# Altium schematic sheet Kasli-SOC_bank33-34-35.SchDoc: Banks 33, 34, 35
size 420 x 297 mm; EDA_Number: EDA-03288-V3-0; CheckedBy: G.Kasprowicz; Author: F.Switakowski; CompanyName: WUT ISE; DrawnBy: F.Switakowski; Organization: WUT ISE; Address1: PW ISE; Address2: Nowowiejska 15/19 00-665 Warsaw; Address3: gkasprow@gmail.com; DocumentNumber: 7; Revision: 1; SheetNumber: 7; SheetTotal: 18; ModifiedBy: -; CheckedDate: -; Title2: EEM LVDS; DivGrp: WUT ISE; Designer: G.Kasprowicz; ModifiedDate: -; ProjectName: Sensor Box
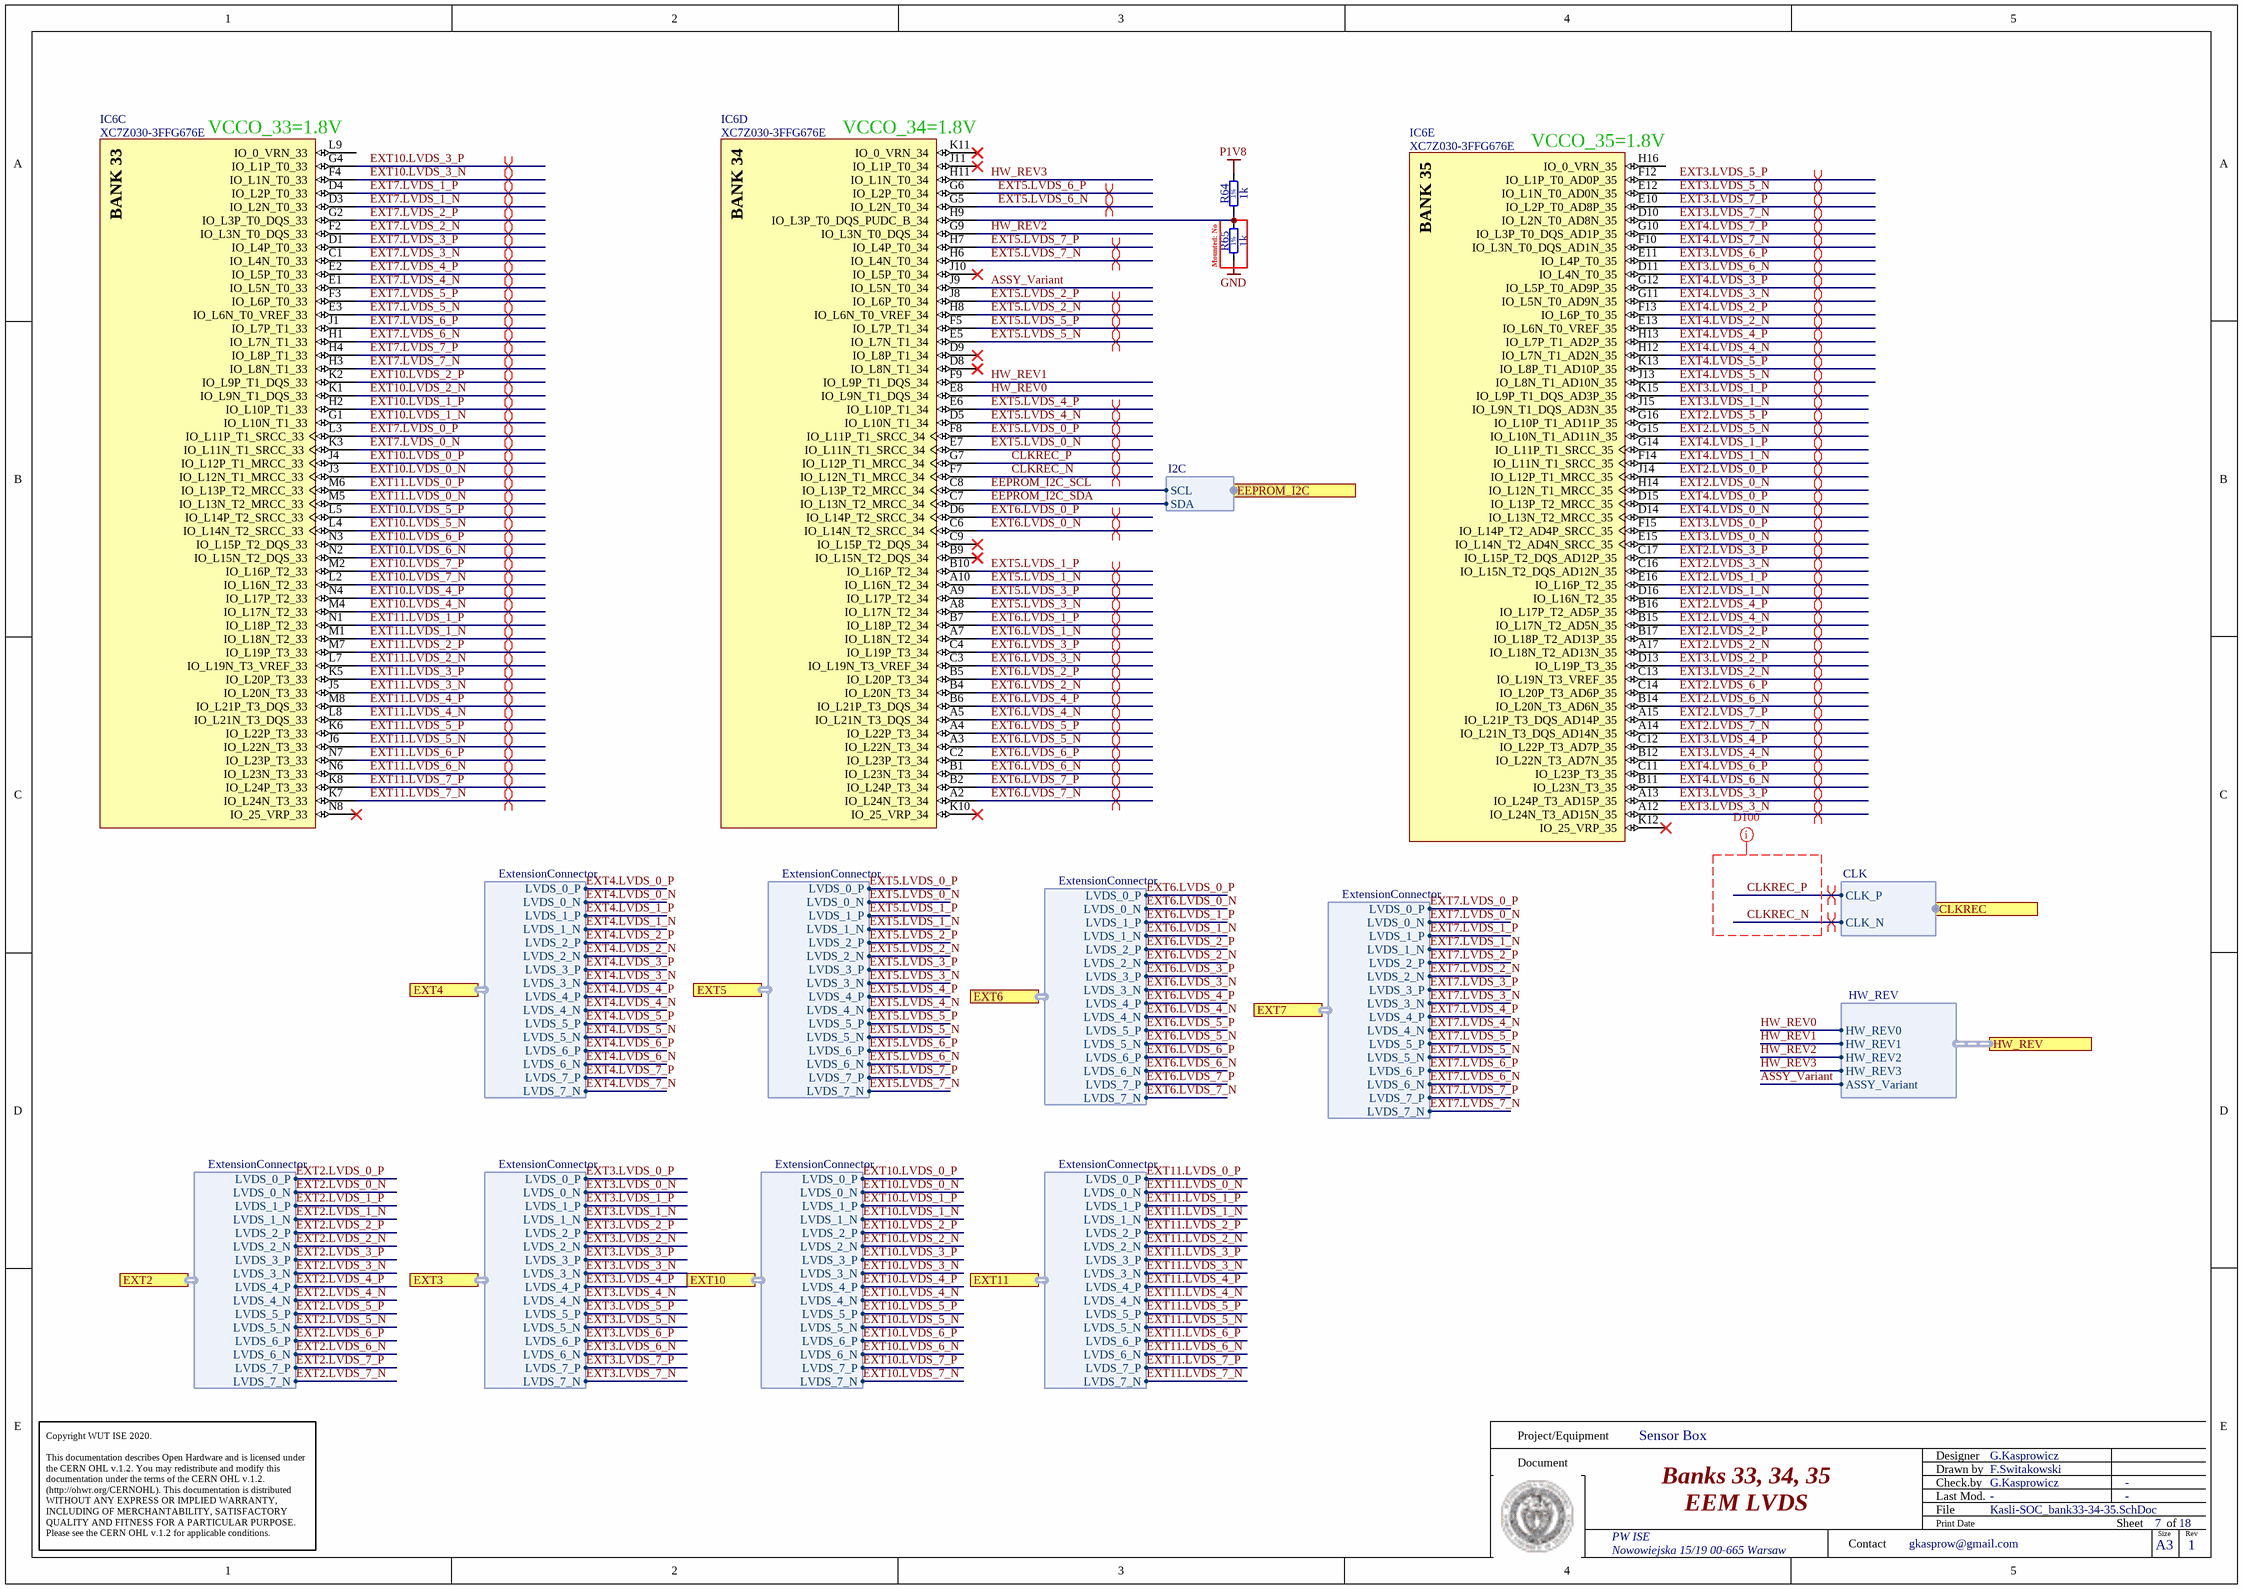
[diagram p0: Kasli-SOC_bank33-34-35.SchDoc]

## Parts
IC6  XC7Z030-3FFG676E  [BGA676C100P26X26_2700X2700X324]  (parts C,D,E of 14)
R64  1k  [RESC1005X40N]
R65  1k  [RESC1005X40N]

## Ports
CLKREC (harness CLK), EEPROM_I2C (harness I2C), EXT2 (harness ExtensionConnector), EXT3 (harness ExtensionConnector), EXT4 (harness ExtensionConnector), EXT5 (harness ExtensionConnector), EXT6 (harness ExtensionConnector), EXT7 (harness ExtensionConnector), EXT10 (harness ExtensionConnector), EXT11 (harness ExtensionConnector), HW_REV (harness HW_REV)

## Harnesses
ExtensionConnector: LVDS_0_N, LVDS_0_P, LVDS_1_N, LVDS_1_P, LVDS_2_N, LVDS_2_P, LVDS_3_N, LVDS_3_P, LVDS_4_N, LVDS_4_P, LVDS_5_N, LVDS_5_P, LVDS_6_N, LVDS_6_P, LVDS_7_N, LVDS_7_P
CLK: CLK_P, CLK_N
I2C: SDA, SCL
HW_REV: ASSY_Variant, HW_REV3, HW_REV2, HW_REV1, HW_REV0

## Nets
GND: R65.1
P1V8: R64.2
ASSY_Variant: IC6.J9(IO_L5N_T0_34) ; port HW_REV.ASSY_Variant
CLKREC_N: IC6.F7(IO_L12N_T1_MRCC_34) ; port CLKREC.CLK_N
CLKREC_P: IC6.G7(IO_L12P_T1_MRCC_34) ; port CLKREC.CLK_P
EEPROM_I2C_SCL: IC6.C8(IO_L13P_T2_MRCC_34) ; port EEPROM_I2C.SCL
EEPROM_I2C_SDA: IC6.C7(IO_L13N_T2_MRCC_34) ; port EEPROM_I2C.SDA
EXT2.LVDS_0_N: IC6.H14(IO_L12N_T1_MRCC_35) ; port EXT2.LVDS_0_N
EXT2.LVDS_0_P: IC6.J14(IO_L12P_T1_MRCC_35) ; port EXT2.LVDS_0_P
EXT2.LVDS_1_N: IC6.D16(IO_L16N_T2_35) ; port EXT2.LVDS_1_N
EXT2.LVDS_1_P: IC6.E16(IO_L16P_T2_35) ; port EXT2.LVDS_1_P
EXT2.LVDS_2_N: IC6.A17(IO_L18N_T2_AD13N_35) ; port EXT2.LVDS_2_N
EXT2.LVDS_2_P: IC6.B17(IO_L18P_T2_AD13P_35) ; port EXT2.LVDS_2_P
EXT2.LVDS_3_N: IC6.C16(IO_L15N_T2_DQS_AD12N_35) ; port EXT2.LVDS_3_N
EXT2.LVDS_3_P: IC6.C17(IO_L15P_T2_DQS_AD12P_35) ; port EXT2.LVDS_3_P
EXT2.LVDS_4_N: IC6.B15(IO_L17N_T2_AD5N_35) ; port EXT2.LVDS_4_N
EXT2.LVDS_4_P: IC6.B16(IO_L17P_T2_AD5P_35) ; port EXT2.LVDS_4_P
EXT2.LVDS_5_N: IC6.G15(IO_L10N_T1_AD11N_35) ; port EXT2.LVDS_5_N
EXT2.LVDS_5_P: IC6.G16(IO_L10P_T1_AD11P_35) ; port EXT2.LVDS_5_P
EXT2.LVDS_6_N: IC6.B14(IO_L20N_T3_AD6N_35) ; port EXT2.LVDS_6_N
EXT2.LVDS_6_P: IC6.C14(IO_L20P_T3_AD6P_35) ; port EXT2.LVDS_6_P
EXT2.LVDS_7_N: IC6.A14(IO_L21N_T3_DQS_AD14N_35) ; port EXT2.LVDS_7_N
EXT2.LVDS_7_P: IC6.A15(IO_L21P_T3_DQS_AD14P_35) ; port EXT2.LVDS_7_P
EXT3.LVDS_0_N: IC6.E15(IO_L14N_T2_AD4N_SRCC_35) ; port EXT3.LVDS_0_N
EXT3.LVDS_0_P: IC6.F15(IO_L14P_T2_AD4P_SRCC_35) ; port EXT3.LVDS_0_P
EXT3.LVDS_1_N: IC6.J15(IO_L9N_T1_DQS_AD3N_35) ; port EXT3.LVDS_1_N
EXT3.LVDS_1_P: IC6.K15(IO_L9P_T1_DQS_AD3P_35) ; port EXT3.LVDS_1_P
EXT3.LVDS_2_N: IC6.C13(IO_L19N_T3_VREF_35) ; port EXT3.LVDS_2_N
EXT3.LVDS_2_P: IC6.D13(IO_L19P_T3_35) ; port EXT3.LVDS_2_P
EXT3.LVDS_3_N: IC6.A12(IO_L24N_T3_AD15N_35) ; port EXT3.LVDS_3_N
EXT3.LVDS_3_P: IC6.A13(IO_L24P_T3_AD15P_35) ; port EXT3.LVDS_3_P
EXT3.LVDS_4_N: IC6.B12(IO_L22N_T3_AD7N_35) ; port EXT3.LVDS_4_N
EXT3.LVDS_4_P: IC6.C12(IO_L22P_T3_AD7P_35) ; port EXT3.LVDS_4_P
EXT3.LVDS_5_N: IC6.E12(IO_L1N_T0_AD0N_35) ; port EXT3.LVDS_5_N
EXT3.LVDS_5_P: IC6.F12(IO_L1P_T0_AD0P_35) ; port EXT3.LVDS_5_P
EXT3.LVDS_6_N: IC6.D11(IO_L4N_T0_35) ; port EXT3.LVDS_6_N
EXT3.LVDS_6_P: IC6.E11(IO_L4P_T0_35) ; port EXT3.LVDS_6_P
EXT3.LVDS_7_N: IC6.D10(IO_L2N_T0_AD8N_35) ; port EXT3.LVDS_7_N
EXT3.LVDS_7_P: IC6.E10(IO_L2P_T0_AD8P_35) ; port EXT3.LVDS_7_P
EXT4.LVDS_0_N: IC6.D14(IO_L13N_T2_MRCC_35) ; port EXT4.LVDS_0_N
EXT4.LVDS_0_P: IC6.D15(IO_L13P_T2_MRCC_35) ; port EXT4.LVDS_0_P
EXT4.LVDS_1_N: IC6.F14(IO_L11N_T1_SRCC_35) ; port EXT4.LVDS_1_N
EXT4.LVDS_1_P: IC6.G14(IO_L11P_T1_SRCC_35) ; port EXT4.LVDS_1_P
EXT4.LVDS_2_N: IC6.E13(IO_L6N_T0_VREF_35) ; port EXT4.LVDS_2_N
EXT4.LVDS_2_P: IC6.F13(IO_L6P_T0_35) ; port EXT4.LVDS_2_P
EXT4.LVDS_3_N: IC6.G11(IO_L5N_T0_AD9N_35) ; port EXT4.LVDS_3_N
EXT4.LVDS_3_P: IC6.G12(IO_L5P_T0_AD9P_35) ; port EXT4.LVDS_3_P
EXT4.LVDS_4_N: IC6.H12(IO_L7N_T1_AD2N_35) ; port EXT4.LVDS_4_N
EXT4.LVDS_4_P: IC6.H13(IO_L7P_T1_AD2P_35) ; port EXT4.LVDS_4_P
EXT4.LVDS_5_N: IC6.J13(IO_L8N_T1_AD10N_35) ; port EXT4.LVDS_5_N
EXT4.LVDS_5_P: IC6.K13(IO_L8P_T1_AD10P_35) ; port EXT4.LVDS_5_P
EXT4.LVDS_6_N: IC6.B11(IO_L23N_T3_35) ; port EXT4.LVDS_6_N
EXT4.LVDS_6_P: IC6.C11(IO_L23P_T3_35) ; port EXT4.LVDS_6_P
EXT4.LVDS_7_N: IC6.F10(IO_L3N_T0_DQS_AD1N_35) ; port EXT4.LVDS_7_N
EXT4.LVDS_7_P: IC6.G10(IO_L3P_T0_DQS_AD1P_35) ; port EXT4.LVDS_7_P
EXT5.LVDS_0_N: IC6.E7(IO_L11N_T1_SRCC_34) ; port EXT5.LVDS_0_N
EXT5.LVDS_0_P: IC6.F8(IO_L11P_T1_SRCC_34) ; port EXT5.LVDS_0_P
EXT5.LVDS_1_N: IC6.A10(IO_L16N_T2_34) ; port EXT5.LVDS_1_N
EXT5.LVDS_1_P: IC6.B10(IO_L16P_T2_34) ; port EXT5.LVDS_1_P
EXT5.LVDS_2_N: IC6.H8(IO_L6N_T0_VREF_34) ; port EXT5.LVDS_2_N
EXT5.LVDS_2_P: IC6.J8(IO_L6P_T0_34) ; port EXT5.LVDS_2_P
EXT5.LVDS_3_N: IC6.A8(IO_L17N_T2_34) ; port EXT5.LVDS_3_N
EXT5.LVDS_3_P: IC6.A9(IO_L17P_T2_34) ; port EXT5.LVDS_3_P
EXT5.LVDS_4_N: IC6.D5(IO_L10N_T1_34) ; port EXT5.LVDS_4_N
EXT5.LVDS_4_P: IC6.E6(IO_L10P_T1_34) ; port EXT5.LVDS_4_P
EXT5.LVDS_5_N: IC6.E5(IO_L7N_T1_34) ; port EXT5.LVDS_5_N
EXT5.LVDS_5_P: IC6.F5(IO_L7P_T1_34) ; port EXT5.LVDS_5_P
EXT5.LVDS_6_N: IC6.G5(IO_L2N_T0_34) ; port EXT5.LVDS_6_N
EXT5.LVDS_6_P: IC6.G6(IO_L2P_T0_34) ; port EXT5.LVDS_6_P
EXT5.LVDS_7_N: IC6.H6(IO_L4N_T0_34) ; port EXT5.LVDS_7_N
EXT5.LVDS_7_P: IC6.H7(IO_L4P_T0_34) ; port EXT5.LVDS_7_P
EXT6.LVDS_0_N: IC6.C6(IO_L14N_T2_SRCC_34) ; port EXT6.LVDS_0_N
EXT6.LVDS_0_P: IC6.D6(IO_L14P_T2_SRCC_34) ; port EXT6.LVDS_0_P
EXT6.LVDS_1_N: IC6.A7(IO_L18N_T2_34) ; port EXT6.LVDS_1_N
EXT6.LVDS_1_P: IC6.B7(IO_L18P_T2_34) ; port EXT6.LVDS_1_P
EXT6.LVDS_2_N: IC6.B4(IO_L20N_T3_34) ; port EXT6.LVDS_2_N
EXT6.LVDS_2_P: IC6.B5(IO_L20P_T3_34) ; port EXT6.LVDS_2_P
EXT6.LVDS_3_N: IC6.C3(IO_L19N_T3_VREF_34) ; port EXT6.LVDS_3_N
EXT6.LVDS_3_P: IC6.C4(IO_L19P_T3_34) ; port EXT6.LVDS_3_P
EXT6.LVDS_4_N: IC6.A5(IO_L21N_T3_DQS_34) ; port EXT6.LVDS_4_N
EXT6.LVDS_4_P: IC6.B6(IO_L21P_T3_DQS_34) ; port EXT6.LVDS_4_P
EXT6.LVDS_5_N: IC6.A3(IO_L22N_T3_34) ; port EXT6.LVDS_5_N
EXT6.LVDS_5_P: IC6.A4(IO_L22P_T3_34) ; port EXT6.LVDS_5_P
EXT6.LVDS_6_N: IC6.B1(IO_L23N_T3_34) ; port EXT6.LVDS_6_N
EXT6.LVDS_6_P: IC6.C2(IO_L23P_T3_34) ; port EXT6.LVDS_6_P
EXT6.LVDS_7_N: IC6.A2(IO_L24N_T3_34) ; port EXT6.LVDS_7_N
EXT6.LVDS_7_P: IC6.B2(IO_L24P_T3_34) ; port EXT6.LVDS_7_P
EXT7.LVDS_0_N: IC6.K3(IO_L11N_T1_SRCC_33) ; port EXT7.LVDS_0_N
EXT7.LVDS_0_P: IC6.L3(IO_L11P_T1_SRCC_33) ; port EXT7.LVDS_0_P
EXT7.LVDS_1_N: IC6.D3(IO_L2N_T0_33) ; port EXT7.LVDS_1_N
EXT7.LVDS_1_P: IC6.D4(IO_L2P_T0_33) ; port EXT7.LVDS_1_P
EXT7.LVDS_2_N: IC6.F2(IO_L3N_T0_DQS_33) ; port EXT7.LVDS_2_N
EXT7.LVDS_2_P: IC6.G2(IO_L3P_T0_DQS_33) ; port EXT7.LVDS_2_P
EXT7.LVDS_3_N: IC6.C1(IO_L4N_T0_33) ; port EXT7.LVDS_3_N
EXT7.LVDS_3_P: IC6.D1(IO_L4P_T0_33) ; port EXT7.LVDS_3_P
EXT7.LVDS_4_N: IC6.E1(IO_L5N_T0_33) ; port EXT7.LVDS_4_N
EXT7.LVDS_4_P: IC6.E2(IO_L5P_T0_33) ; port EXT7.LVDS_4_P
EXT7.LVDS_5_N: IC6.E3(IO_L6N_T0_VREF_33) ; port EXT7.LVDS_5_N
EXT7.LVDS_5_P: IC6.F3(IO_L6P_T0_33) ; port EXT7.LVDS_5_P
EXT7.LVDS_6_N: IC6.H1(IO_L7N_T1_33) ; port EXT7.LVDS_6_N
EXT7.LVDS_6_P: IC6.J1(IO_L7P_T1_33) ; port EXT7.LVDS_6_P
EXT7.LVDS_7_N: IC6.H3(IO_L8N_T1_33) ; port EXT7.LVDS_7_N
EXT7.LVDS_7_P: IC6.H4(IO_L8P_T1_33) ; port EXT7.LVDS_7_P
EXT10.LVDS_0_N: IC6.J3(IO_L12N_T1_MRCC_33) ; port EXT10.LVDS_0_N
EXT10.LVDS_0_P: IC6.J4(IO_L12P_T1_MRCC_33) ; port EXT10.LVDS_0_P
EXT10.LVDS_1_N: IC6.G1(IO_L10N_T1_33) ; port EXT10.LVDS_1_N
EXT10.LVDS_1_P: IC6.H2(IO_L10P_T1_33) ; port EXT10.LVDS_1_P
EXT10.LVDS_2_N: IC6.K1(IO_L9N_T1_DQS_33) ; port EXT10.LVDS_2_N
EXT10.LVDS_2_P: IC6.K2(IO_L9P_T1_DQS_33) ; port EXT10.LVDS_2_P
EXT10.LVDS_3_N: IC6.F4(IO_L1N_T0_33) ; port EXT10.LVDS_3_N
EXT10.LVDS_3_P: IC6.G4(IO_L1P_T0_33) ; port EXT10.LVDS_3_P
EXT10.LVDS_4_N: IC6.M4(IO_L17N_T2_33) ; port EXT10.LVDS_4_N
EXT10.LVDS_4_P: IC6.N4(IO_L17P_T2_33) ; port EXT10.LVDS_4_P
EXT10.LVDS_5_N: IC6.L4(IO_L14N_T2_SRCC_33) ; port EXT10.LVDS_5_N
EXT10.LVDS_5_P: IC6.L5(IO_L14P_T2_SRCC_33) ; port EXT10.LVDS_5_P
EXT10.LVDS_6_N: IC6.N2(IO_L15N_T2_DQS_33) ; port EXT10.LVDS_6_N
EXT10.LVDS_6_P: IC6.N3(IO_L15P_T2_DQS_33) ; port EXT10.LVDS_6_P
EXT10.LVDS_7_N: IC6.L2(IO_L16N_T2_33) ; port EXT10.LVDS_7_N
EXT10.LVDS_7_P: IC6.M2(IO_L16P_T2_33) ; port EXT10.LVDS_7_P
EXT11.LVDS_0_N: IC6.M5(IO_L13N_T2_MRCC_33) ; port EXT11.LVDS_0_N
EXT11.LVDS_0_P: IC6.M6(IO_L13P_T2_MRCC_33) ; port EXT11.LVDS_0_P
EXT11.LVDS_1_N: IC6.M1(IO_L18N_T2_33) ; port EXT11.LVDS_1_N
EXT11.LVDS_1_P: IC6.N1(IO_L18P_T2_33) ; port EXT11.LVDS_1_P
EXT11.LVDS_2_N: IC6.L7(IO_L19N_T3_VREF_33) ; port EXT11.LVDS_2_N
EXT11.LVDS_2_P: IC6.M7(IO_L19P_T3_33) ; port EXT11.LVDS_2_P
EXT11.LVDS_3_N: IC6.J5(IO_L20N_T3_33) ; port EXT11.LVDS_3_N
EXT11.LVDS_3_P: IC6.K5(IO_L20P_T3_33) ; port EXT11.LVDS_3_P
EXT11.LVDS_4_N: IC6.L8(IO_L21N_T3_DQS_33) ; port EXT11.LVDS_4_N
EXT11.LVDS_4_P: IC6.M8(IO_L21P_T3_DQS_33) ; port EXT11.LVDS_4_P
EXT11.LVDS_5_N: IC6.J6(IO_L22N_T3_33) ; port EXT11.LVDS_5_N
EXT11.LVDS_5_P: IC6.K6(IO_L22P_T3_33) ; port EXT11.LVDS_5_P
EXT11.LVDS_6_N: IC6.N6(IO_L23N_T3_33) ; port EXT11.LVDS_6_N
EXT11.LVDS_6_P: IC6.N7(IO_L23P_T3_33) ; port EXT11.LVDS_6_P
EXT11.LVDS_7_N: IC6.K7(IO_L24N_T3_33) ; port EXT11.LVDS_7_N
EXT11.LVDS_7_P: IC6.K8(IO_L24P_T3_33) ; port EXT11.LVDS_7_P
HW_REV0: IC6.E8(IO_L9N_T1_DQS_34) ; port HW_REV.HW_REV0
HW_REV1: IC6.F9(IO_L9P_T1_DQS_34) ; port HW_REV.HW_REV1
HW_REV2: IC6.G9(IO_L3N_T0_DQS_34) ; port HW_REV.HW_REV2
HW_REV3: IC6.H11(IO_L1N_T0_34) ; port HW_REV.HW_REV3
NetIC6_H9: IC6.H9(IO_L3P_T0_DQS_PUDC_B_34) R64.1 R65.2

Not connected (* = marked no-connect by the designer): IC6 B9(IO_L15N_T2_DQS_34)* C9(IO_L15P_T2_DQS_34)* D8(IO_L8N_T1_34)* D9(IO_L8P_T1_34)* H16(IO_0_VRN_35) J10(IO_L5P_T0_34)* J11(IO_L1P_T0_34)* K10(IO_25_VRP_34)* K11(IO_0_VRN_34)* K12(IO_25_VRP_35)* L9(IO_0_VRN_33) N8(IO_25_VRP_33)*

## Layout directives
differential pair: CLKREC_N, CLKREC_P, EXT2.LVDS_0_N, EXT2.LVDS_0_P, EXT2.LVDS_1_N, EXT2.LVDS_1_P, EXT2.LVDS_2_N, EXT2.LVDS_2_P, EXT2.LVDS_3_N, EXT2.LVDS_3_P, EXT2.LVDS_4_N, EXT2.LVDS_4_P, EXT2.LVDS_5_N, EXT2.LVDS_5_P, EXT2.LVDS_6_N, EXT2.LVDS_6_P, EXT2.LVDS_7_N, EXT2.LVDS_7_P, EXT3.LVDS_0_N, EXT3.LVDS_0_P, EXT3.LVDS_1_N, EXT3.LVDS_1_P, EXT3.LVDS_2_N, EXT3.LVDS_2_P, EXT3.LVDS_3_N, EXT3.LVDS_3_P, EXT3.LVDS_4_N, EXT3.LVDS_4_P, EXT3.LVDS_5_N, EXT3.LVDS_5_P, EXT3.LVDS_6_N, EXT3.LVDS_6_P, EXT3.LVDS_7_N, EXT3.LVDS_7_P, EXT4.LVDS_0_N, EXT4.LVDS_0_P, EXT4.LVDS_1_N, EXT4.LVDS_1_P, EXT4.LVDS_2_N, EXT4.LVDS_2_P, EXT4.LVDS_3_N, EXT4.LVDS_3_P, EXT4.LVDS_4_N, EXT4.LVDS_4_P, EXT4.LVDS_5_N, EXT4.LVDS_5_P, EXT4.LVDS_6_N, EXT4.LVDS_6_P, EXT4.LVDS_7_N, EXT4.LVDS_7_P, EXT5.LVDS_0_N, EXT5.LVDS_0_P, EXT5.LVDS_1_N, EXT5.LVDS_1_P, EXT5.LVDS_2_N, EXT5.LVDS_2_P, EXT5.LVDS_3_N, EXT5.LVDS_3_P, EXT5.LVDS_4_N, EXT5.LVDS_4_P, EXT5.LVDS_5_N, EXT5.LVDS_5_P, EXT5.LVDS_6_N, EXT5.LVDS_6_P, EXT5.LVDS_7_N, EXT5.LVDS_7_P, EXT6.LVDS_0_N, EXT6.LVDS_0_P, EXT6.LVDS_1_N, EXT6.LVDS_1_P, EXT6.LVDS_2_N, EXT6.LVDS_2_P, EXT6.LVDS_3_N, EXT6.LVDS_3_P, EXT6.LVDS_4_N, EXT6.LVDS_4_P, EXT6.LVDS_5_N, EXT6.LVDS_5_P, EXT6.LVDS_6_N, EXT6.LVDS_6_P, EXT6.LVDS_7_N, EXT6.LVDS_7_P, EXT7.LVDS_0_N, EXT7.LVDS_0_P, EXT7.LVDS_1_N, EXT7.LVDS_1_P, EXT7.LVDS_2_N, EXT7.LVDS_2_P, EXT7.LVDS_3_N, EXT7.LVDS_3_P, EXT7.LVDS_4_N, EXT7.LVDS_4_P, EXT7.LVDS_5_N, EXT7.LVDS_5_P, EXT7.LVDS_6_N, EXT7.LVDS_6_P, EXT7.LVDS_7_N, EXT7.LVDS_7_P, EXT10.LVDS_0_N, EXT10.LVDS_0_P, EXT10.LVDS_1_N, EXT10.LVDS_1_P, EXT10.LVDS_2_N, EXT10.LVDS_2_P, EXT10.LVDS_3_N, EXT10.LVDS_3_P, EXT10.LVDS_4_N, EXT10.LVDS_4_P, EXT10.LVDS_5_N, EXT10.LVDS_5_P, EXT10.LVDS_6_N, EXT10.LVDS_6_P, EXT10.LVDS_7_N, EXT10.LVDS_7_P, EXT11.LVDS_0_N, EXT11.LVDS_0_P, EXT11.LVDS_1_N, EXT11.LVDS_1_P, EXT11.LVDS_2_N, EXT11.LVDS_2_P, EXT11.LVDS_3_N, EXT11.LVDS_3_P, EXT11.LVDS_4_N, EXT11.LVDS_4_P, EXT11.LVDS_5_N, EXT11.LVDS_5_P, EXT11.LVDS_6_N, EXT11.LVDS_6_P, EXT11.LVDS_7_N, EXT11.LVDS_7_P
net class D100: CLKREC_N, CLKREC_P

## Notes on the sheet
- (near IC6) VCCO_33=1.8V
- (near IC6) VCCO_34=1.8V
- (near IC6) VCCO_35=1.8V
- (near R65) Mounted: No
- Project/Equipment
- Document
- Designer
- Drawn by
- Check.by
- Copyright WUT ISE 2020.
  This documentation describes Open Hardware and is licensed under the CERN OHL v.1.2. You may redistribute and modify this documentation under the terms of the CERN OHL v.1.2. (http://ohwr.org/CERNOHL). This documentation is distributed WITHOUT ANY EXPRESS OR IMPLIED WARRANTY, INCLUDING OF MERCHANTABILITY, SATISFACTORY QUALITY AND FITNESS FOR A PARTICULAR PURPOSE. Please see the CERN OHL v.1.2 for applicable conditions.
- Contact
- File
- Last Mod.
- Print Date
- Sheet
- Size
- A3
- of
- Rev
- (in symbol R0402_1K_1%_0.0625W_100PPM) 1%
- (in symbol XC7Z030-2FFG676I, part C) BANK 33
- (in symbol XC7Z030-2FFG676I, part D) BANK 34
- (in symbol XC7Z030-2FFG676I, part E) BANK 35

## Library data of the parts
IC6 = XC7Z030-2FFG676I: 733 MHz Zynq™-7000 AP SoC, 130 PS I/O, 254 FPGA I/O, 676-Ball BGA, Speed Grade 2, Industrial Grade, Pb-Free; Part Description: Zynq™-7000 All Programmable SoC, Dual-core ARM® Cortex™-A9 CPU, 676-Ball BGA, Speed Grade 2, Industrial Grade, Pb-Free; Manufacturer: XILINX; PressFit: No; Bonding: No; Part Number: XC7Z030-3FFG676E; Component Kind: Standard; Component Type: Standard; Device: XC7Z030-2FFG676I; PackageDescription: BGA, 1.00mm Pitch, Square; 676 Pin, 26 Columns X 26 Rows, 27.00mm X 27.00mm X 2.60mm H; Manufacturer Part Number: XC7Z030-3FFG676E; Pin Count: 676; Case: BGA676; Mounted: Yes; Socket: No; SMD: Yes; Sense: No; ComponentHeight: 3.24mm; HelpURL: \\cern.ch\dfs\Applications\Altium\Datasheets\XC7Z030-2FFG676I.pdf; ComponentLink1URL: \\cern.ch\dfs\Applications\Altium\Datasheets\XC7Z030-2FFG676I_Package.pdf; ComponentLink1Description: Package; ComponentLink2URL: \\cern.ch\dfs\Applications\Altium\Datasheets\XC7Z030-2FFG676I_Pinout.txt; ComponentLink2Description: Pinout; Author: CERN DEM JLC; CreateDate: 29/04/2014; LatestRevisionDate: 29/04/2014
R64 R65 = R0402_1K_1%_0.0625W_100PPM: Resistor - 1%; Part Description: General Purpose Thick Film Chip Resistor; Manufacturer: GENERIC; Manufacturer1 Part Number: 232270671002L; TC: ±100ppm/°C; PressFit: No; Part Number: R0402_1K_1%_0.0625W_100PPM; Component Kind: Standard; Component Type: Standard; Pin Count: 2; Value: 1k; Status: Not Recommended; Power: 0.0625W; Tolerance: ±1%; Manufacturer Part Number: R0402_1K_1%_0.0625W_100PPM; Case: 0402; Mounted: Yes; Sense: No; Socket: No; SMD: Yes; Manufacturer1 Example: YAGEO PHYCOMP; Manufacturer1 ComponentHeight: 0.4mm; HelpURL: \\cern.ch\dfs\Applications\Altium\Datasheets\R0402_Phycomp_RC0402.pdf; Author: CERN DEM JLC; CreateDate: 03.12.2007; LatestRevisionDate: 17.10.2012